# Altium project Main Pcb of Mobile robot.PrjPcb
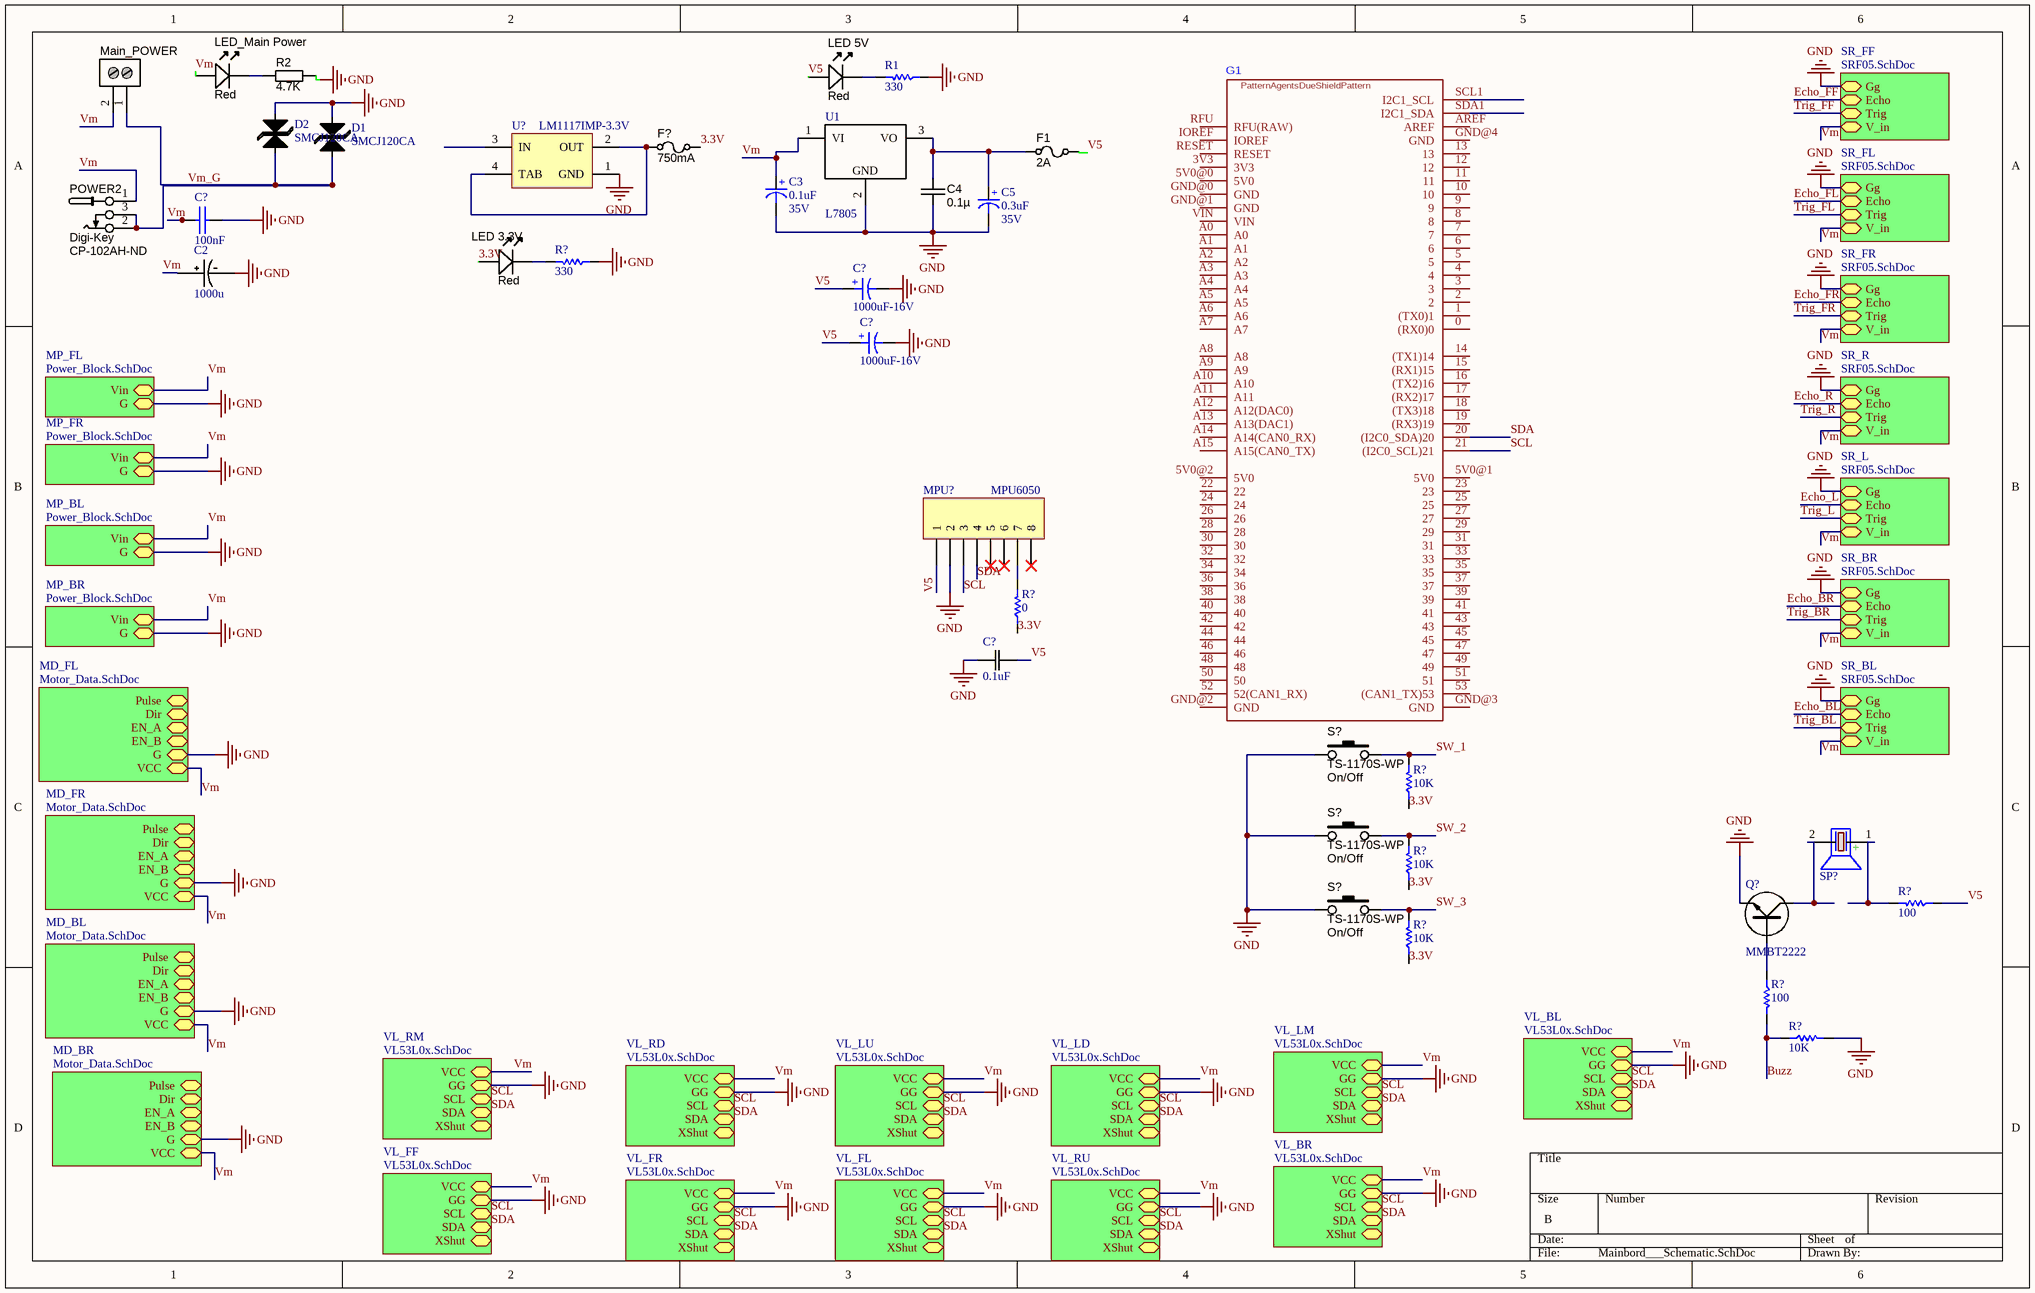
[diagram p0: Mainbord___Schematic.SchDoc]
9 sheets, 86 parts. Net scope: hierarchical (ports join the sheet entries above them; power ports are global).
Board file: Mainbord___PCB.PcbDoc
Sheets:
  Mainbord___Schematic.SchDoc
    MP_FR = Power_Block.SchDoc
    VL_FF = VL53L0x.SchDoc
    MP_FL = Power_Block.SchDoc
    MP_BL = Power_Block.SchDoc
    MP_BR = Power_Block.SchDoc
    SR_FF = SRF05.SchDoc
    SR_FL = SRF05.SchDoc
    SR_FR = SRF05.SchDoc
    SR_R = SRF05.SchDoc
    SR_L = SRF05.SchDoc
    SR_BR = SRF05.SchDoc
    SR_BL = SRF05.SchDoc
    MD_FL = Motor_Data.SchDoc
    MD_FR = Motor_Data.SchDoc
    MD_BL = Motor_Data.SchDoc
    MD_BR = Motor_Data.SchDoc
    VL_FR = VL53L0x.SchDoc
    VL_FL = VL53L0x.SchDoc
    VL_RM = VL53L0x.SchDoc
    VL_RD = VL53L0x.SchDoc
    VL_LU = VL53L0x.SchDoc
    VL_RU = VL53L0x.SchDoc
    VL_LD = VL53L0x.SchDoc
    VL_LM = VL53L0x.SchDoc
    VL_BR = VL53L0x.SchDoc
    VL_BL = VL53L0x.SchDoc
  Wifi.SchDoc
  ACC.SchDoc
  Power_24 to 12.SchDoc
  RadioControl.SchDoc

## Sheet Mainbord___Schematic.SchDoc
size B

### Parts
(Parts that share a designator on the sheet are numbered #1, #2 ... from top to bottom, then left to right.)
C2  1000u  [Cap electrolitic radial 10x16-5]
C3  Voltage: 35V  [cap 00]  (hidden comment: 0.1uF)
C4  value 0.1µ  [CAPC2012X135N]  (hidden comment: approved sub OK)
C5  Voltage: 35V  [cap 00]  (hidden comment: 0.3uF)
C?#1  100nF  [Cap - 100nF - 2]
C?#2  1000uF-16V  [CAP SMD 1000UF 16V]
C?#3  1000uF-16V  [CAP SMD 1000UF 16V]
C?#4  0.1uF  [0805]
D1  SMCJ120CA  [DIODE-SMC]
D2  SMCJ120CA  [DIODE-SMC]
F1  value 2A  [RESC3216X70N]  (hidden comment: Slow-blow)
F?  value 750mA  [RESC3216X70N]  (hidden comment: Slow-blow)
G1  (no value)  [Arduino_Due]
LED_3.3V  Color: Red  [LED-0805-K]
LED_5V  Color: Red  [LED-0805-K]
LED_Main_Power  Color: Red  [LED-0805-K]
Main_POWER  Stackable ScrewTerm  [CONN-TH_P9.50_KF950-9.5-2P]  (value not drawn)
MPU?  MPU6050  [HDR1X8]
POWER2  Supplier 1: Digi-Key  Supplier Part Number 1: CP-102AH-ND  [CONN_PWR_JACK_2.1x5.5mm]  (hidden comment: CONN_PWR_JACK_2.1x5.5mm)
Q?  MMBT2222  [SOT23-BCE]
R1  330  [RES 0805 (2012X06L)]
R2  value 4.7K  [RESC3216X70N]  (hidden comment: Thin Film)
R?#1  330  [RES 0805 (2012X06L)]
R?#2  0  [SMD_RES_0805]
R?#3  10K  [RES 0805 (2012X06L)]
R?#4  10K  [RES 0805 (2012X06L)]
R?#5  100  [RES 0805 (2012X06L)]
R?#6  10K  [RES 0805 (2012X06L)]
R?#7  100  [RES 0805 (2012X06L)]
R?#8  10K  [RES 0805 (2012X06L)]
S?#1  TS-1170S-WP  Function: On/Off  [TS-1170S]
S?#2  TS-1170S-WP  Function: On/Off  [TS-1170S]
S?#3  TS-1170S-WP  Function: On/Off  [TS-1170S]
SP?  (no value)  [BUZZER 7.62mm DC]
U1  L7805  [TO252-3M]
U?  LM1117IMP-3.3V  [TO-252]

### Sub-sheets
MD_BL = Motor_Data.SchDoc: Pulse (bidir), Dir (bidir), EN_A (bidir), EN_B (bidir), G (bidir), VCC (bidir)
MD_BR = Motor_Data.SchDoc: Pulse (bidir), Dir (bidir), EN_A (bidir), EN_B (bidir), G (bidir), VCC (bidir)
MD_FL = Motor_Data.SchDoc: Pulse (bidir), Dir (bidir), EN_A (bidir), EN_B (bidir), G (bidir), VCC (bidir)
MD_FR = Motor_Data.SchDoc: Pulse (bidir), Dir (bidir), EN_A (bidir), EN_B (bidir), G (bidir), VCC (bidir)
MP_BL = Power_Block.SchDoc: Vin (bidir), G (bidir)
MP_BR = Power_Block.SchDoc: Vin (bidir), G (bidir)
MP_FL = Power_Block.SchDoc: Vin (bidir), G (bidir)
MP_FR = Power_Block.SchDoc: Vin (bidir), G (bidir)
SR_BL = SRF05.SchDoc: Gg (bidir), V_in (bidir), Trig (bidir), Echo (bidir)
SR_BR = SRF05.SchDoc: Gg (bidir), V_in (bidir), Trig (bidir), Echo (bidir)
SR_FF = SRF05.SchDoc: Gg (bidir), V_in (bidir), Trig (bidir), Echo (bidir)
SR_FL = SRF05.SchDoc: Gg (bidir), V_in (bidir), Trig (bidir), Echo (bidir)
SR_FR = SRF05.SchDoc: Gg (bidir), V_in (bidir), Trig (bidir), Echo (bidir)
SR_L = SRF05.SchDoc: Gg (bidir), V_in (bidir), Trig (bidir), Echo (bidir)
SR_R = SRF05.SchDoc: Gg (bidir), V_in (bidir), Trig (bidir), Echo (bidir)
VL_BL = VL53L0x.SchDoc: VCC (bidir), GG (bidir), SCL (bidir), SDA (bidir), XShut (bidir)
VL_BR = VL53L0x.SchDoc: VCC (bidir), GG (bidir), SCL (bidir), SDA (bidir), XShut (bidir)
VL_FF = VL53L0x.SchDoc: VCC (bidir), GG (bidir), SCL (bidir), SDA (bidir), XShut (bidir)
VL_FL = VL53L0x.SchDoc: VCC (bidir), GG (bidir), SCL (bidir), SDA (bidir), XShut (bidir)
VL_FR = VL53L0x.SchDoc: VCC (bidir), GG (bidir), SCL (bidir), SDA (bidir), XShut (bidir)
VL_LD = VL53L0x.SchDoc: VCC (bidir), GG (bidir), SCL (bidir), SDA (bidir), XShut (bidir)
VL_LM = VL53L0x.SchDoc: VCC (bidir), GG (bidir), SCL (bidir), SDA (bidir), XShut (bidir)
VL_LU = VL53L0x.SchDoc: VCC (bidir), GG (bidir), SCL (bidir), SDA (bidir), XShut (bidir)
VL_RD = VL53L0x.SchDoc: VCC (bidir), GG (bidir), SCL (bidir), SDA (bidir), XShut (bidir)
VL_RM = VL53L0x.SchDoc: VCC (bidir), GG (bidir), SCL (bidir), SDA (bidir), XShut (bidir)
VL_RU = VL53L0x.SchDoc: VCC (bidir), GG (bidir), SCL (bidir), SDA (bidir), XShut (bidir)

### Nets
GND: C2.NEG C3.2(-) C4.2 C5.2(-) C?#1.2(-) C?#2.2 C?#3.2 C?#4.1(C1) D1.A D2.A MPU?.2 Q?.E R1.1 R2.2 R?#1.1 R?#8.2 S?#1.1 S?#2.1 S?#3.1 U1.2 U?.1(GND) ; sheet MP_FR/G, sheet VL_FF/GG, sheet MP_FL/G, sheet MP_BL/G, sheet MP_BR/G, sheet SR_FF/Gg, sheet SR_FL/Gg, sheet SR_FR/Gg, sheet SR_R/Gg, sheet SR_L/Gg, sheet SR_BR/Gg, sheet SR_BL/Gg, sheet MD_FL/G, sheet MD_FR/G, sheet MD_BL/G, sheet MD_BR/G, sheet VL_FR/GG, sheet VL_FL/GG, sheet VL_RM/GG, sheet VL_RD/GG, sheet VL_LU/GG, sheet VL_RU/GG, sheet VL_LD/GG, sheet VL_LM/GG, sheet VL_BR/GG, sheet VL_BL/GG  [project net G]
3.3V: F?.1 LED_3.3V.A R?#2.1 R?#3.1 R?#4.1 R?#6.1
Buzz: R?#7.2 R?#8.1
SCL: G1.21((I2C0_SCL)21) MPU?.3 ; sheet VL_FF/SCL, sheet VL_FR/SCL, sheet VL_FL/SCL, sheet VL_RM/SCL, sheet VL_RD/SCL, sheet VL_LU/SCL, sheet VL_RU/SCL, sheet VL_LD/SCL, sheet VL_LM/SCL, sheet VL_BR/SCL, sheet VL_BL/SCL
SDA: G1.20((I2C0_SDA)20) MPU?.4 ; sheet VL_FF/SDA, sheet VL_FR/SDA, sheet VL_FL/SDA, sheet VL_RM/SDA, sheet VL_RD/SDA, sheet VL_LU/SDA, sheet VL_RU/SDA, sheet VL_LD/SDA, sheet VL_LM/SDA, sheet VL_BR/SDA, sheet VL_BL/SDA
SW_1: R?#3.2 S?#1.2
SW_2: R?#4.2 S?#2.2
SW_3: R?#6.2 S?#3.2
V5: C?#2.1 C?#3.1 C?#4.2(C2) F1.2 LED_5V.A MPU?.1 R?#5.1
Vm: C2.POS C3.1(+) C?#1.1(+) LED_Main_Power.A Main_POWER.2 POWER2.1 U1.1(VI) ; sheet MP_FR/Vin, sheet VL_FF/VCC, sheet MP_FL/Vin, sheet MP_BL/Vin, sheet MP_BR/Vin, sheet SR_FF/V_in, sheet SR_FL/V_in, sheet SR_FR/V_in, sheet SR_R/V_in, sheet SR_L/V_in, sheet SR_BR/V_in, sheet SR_BL/V_in, sheet MD_FL/VCC, sheet MD_FR/VCC, sheet MD_BL/VCC, sheet MD_BR/VCC, sheet VL_FR/VCC, sheet VL_FL/VCC, sheet VL_RM/VCC, sheet VL_RD/VCC, sheet VL_LU/VCC, sheet VL_RU/VCC, sheet VL_LD/VCC, sheet VL_LM/VCC, sheet VL_BR/VCC, sheet VL_BL/VCC  [project net V5]
Vm_G: D1.K D2.K Main_POWER.1 POWER2.2 POWER2.3
NetC4_1: C4.1 C5.1(+) F1.1 U1.3(VO)
NetF?_2: F?.2 U?.2(OUT) U?.4(TAB)
NetLED_3.3V_K: LED_3.3V.K R?#1.2
NetLED_5V_K: LED_5V.K R1.2
NetLED_Main_Power_K: LED_Main_Power.K R2.1
NetMPU?_7: MPU?.7 R?#2.2
NetQ?_B: Q?.B R?#7.1
NetQ?_C: Q?.C SP?.2(-)
NetR?#5_2: R?#5.2 SP?.1(+)

Not connected (* = marked no-connect by the designer): G1 0((RX0)0) 1((TX0)1) 2 3 3V3 4 5 5V0@0(5V0) 5V0@1(5V0) 5V0@2(5V0) 6 7 8 9 10 11 12 13 14((TX1)14) 15((RX1)15) 16((TX2)16) 17((RX2)17) 18((TX3)18) 19((RX3)19) 22 23 24 25 26 27 28 29 30 31 32 33 34 35 36 37 38 39 40 41 42 43 44 45 46 47 48 49 50 51 52(52(CAN1_RX)) 53((CAN1_TX)53) A0 A1 A2 A3 A4 A5 A6 A7 A8 A9 A10 A11 A12(A12(DAC0)) A13(A13(DAC1)) A14(A14(CAN0_RX)) A15(A15(CAN0_TX)) AREF GND@0(GND) GND@1(GND) GND@2(GND) GND@3(GND) GND@4(GND) IOREF RESET RFU(RFU(RAW)) SCL1(I2C1_SCL) SDA1(I2C1_SDA) VIN; MPU? 5* 6* 8*; U? 3(IN)

### Notes on the sheet
- (in symbol ARDUINO DUE V2) PatternAgentsDueShieldPattern
- (in symbol Cap ELECTROLITIC TOTAL SIZE) +
- (in symbol L7805-D2PAK) GND

### Library data of the parts
C2 = CAP POL 1000uF TH: NICHICON   UVR1E102MPD1TD   ALUMINUM ELECTROLYTIC CAPACITOR, 1000UF, 25V, 20%, RADIAL, FULL REEL; pin to pad: NEG>2 POS>1; Dielectric Material: Aluminium; Life (Hours): 2000Hour; Capacitance: 1mF; Leakage Current: 750uA; Dissipation Factor: 0.16%; Ripple Current: 960mA; Lead Diameter: 0.6mm; Supplier 1: Digi-Key; Manufacturer: Nichicon; Manufacturer Part Number: UVR1E102MPD1TD; RoHS: Yes; Category: Aluminum Electrolytic Capacitors; Stock 1: 43448; Pricing 1: 1=0.58000, 10=0.40800, 100=0.26890 (USD); Mount: Through Hole,PCB; Case/Package: Radial; Number of Pins: 2; Min Operating Temperature: -40°C; Max Operating Temperature: 85°C; Packaging: Tape and Reel; Tolerance: 20%; Voltage Rating (DC): 25V; Voltage Rating: 25V; Termination: Radial; Voltage: 25V; Package Quantity: 500; Diameter: 10mm; Length: 20mm; Height: 20mm; Height - Seated (Max): 0.866inch; Lead Pitch: 5mm; Radiation Hardening: No; REACH SVHC: No SVHC; Lead Free: Lead Free; ComponentLink1URL: https://datasheet.ciiva.com/7851/e-vr-7851718.pdf?src-supplier=Element14; ComponentLink1Description: https://datasheet.ciiva.com/7851/e-vr-7851718.pdf?src-supplier=Element14; ComponentLink2URL: https://datasheet.ciiva.com/6300/e-vr-6300009.pdf?src-supplier=Digi-Key; ComponentLink2Description: https://datasheet.ciiva.com/6300/e-vr-6300009.pdf?src-supplier=Digi-Key; ComponentLink3URL: https://datasheet.ciiva.com/6300/e-vr-6300010.pdf?src-supplier=Digi-Key; ComponentLink3Description: https://datasheet.ciiva.com/6300/e-vr-6300010.pdf?src-supplier=Digi-Key; ComponentLink4URL: https://datasheet.ciiva.com/11684/e-vr-11684106.pdf?src-supplier=Avnet; ComponentLink4Description: https://datasheet.ciiva.com/11684/e-vr-11684106.pdf?src-supplier=Avnet; ComponentLink5URL: https://datasheet.ciiva.com/16502/e-vr-16502813.pdf?src-supplier=Future+Electronics; ComponentLink5Description: https://datasheet.ciiva.com/16502/e-vr-16502813.pdf?src-supplier=Future+Electronics; ComponentLink6URL: https://datasheet.ciiva.com/46381/1909356-46381757.pdf?src-supplier=Element14; ComponentLink6Description: https://datasheet.ciiva.com/46381/1909356-46381757.pdf?src-supplier=Element14; Supplier Part Number 1: 493-5913-1-ND
C3 C5 = Cap-Polar: Polar Capacitor; Designer: Saeid Jorablo; Organazation: ControTec; Adding Date: 1387/12/20
  C3: Value: 0.1uF
  C5: Value: 0.3uF
C4 = CAPC_1u_0805_X7R_16V_10%: Capacitor SMD Cer 1uF 10% 16V X7R 0805; Manufacturer 1: Yageo; Manufacturer Part Number 1: CC0805KKX7R7BB105; Ratings: 16V; X7R; Material: ceramic; SCDType: spec; Package / Case: 0805 (2012 metric); Tolerance: ±10%; Supplier 1: Digi-Key; Supplier Part Number 1: 311-1365-6-ND; RoHS 1: RoHS Compliant; Temperature Coefficient: X7R; ComponentLink1URL: http://www.yageo.com/documents/recent/UPY-GPHC_X7R_6.3V-to-50V_8.pdf; ComponentLink1Description: http://www.yageo.com/documents/recent/UPY-GPHC_X7R_6.3V-to-50V_8.pdf; Supplier 2: Digi-Key; Supplier Part Number 2: 399-1284-6-ND; Manufacturer 2: Kemet; Manufacturer Part Number 2: C0805C105K4RACTU; RoHS 2: RoHS Compliant; ComponentLink2URL: http://www.kemet.com/datasheets&C0805C105K4RACTU; ComponentLink2Description: http://www.kemet.com/datasheets&C0805C105K4RACTU; Supplier 3: Digi-Key; Supplier Part Number 3: 1276-1026-6-ND; Manufacturer 3: Samsung Electro-Mechanics America, Inc; Manufacturer Part Number 3: CL21B105KOFNNNE; RoHS 3: RoHS Compliant; ComponentLink3URL: http://www.samsungsem.com/servlet/FileDownload?type=spec&file=CL21B105KOFNNNE.pdf; ComponentLink3Description: http://www.samsungsem.com/servlet/FileDownload?type=spec&file=CL21B105KOFNNNE.pdf; Supplier 4: Digi-Key; Supplier Part Number 4: 445-1358-6-ND; Manufacturer 4: TDK Corporation; Manufacturer Part Number 4: C2012X7R1C105K125AA; RoHS 4: RoHS Compliant; ComponentLink4URL: http://product.tdk.com/capacitor/mlcc/en/documents/mlcc_commercial_general_en.pdf; ComponentLink4Description: http://product.tdk.com/capacitor/mlcc/en/documents/mlcc_commercial_general_en.pdf
C?#1 = Cap-Bipolar: Bipolar Capacitor; Voltage: 100V; Designer: Saeid Jorablo; Organazation: ControTec; Adding Date: 1387/12/20; Value: 100nF
C?#2 C?#3 = Cap ELECTROLITIC TOTAL SIZE: Cap electrolitic radial; Designer: Abbas Basereh; Data: 16-12-2016; Part. No: *; VALUE: 1000uF-16V
C?#4 = CAP 470nF 50V: CAP CER 0.1UF 50V X7R 0805; Value: 470nF; Tolerance: 10%; Package: 0805; Rating: 50V
D1 D2 = SMCJ120CA: Transient Surpression Diode TVS; Supplier 1: Digi-Key; Supplier Part Number 1: SMCJ120CABTR-ND
F1 F? = FUSE_160mA_1206: Fuse 160mA 63VDC 1206 SMD; Manufacturer 1: Holly Fuse; Manufacturer Part Number 1: 12T-0160L; Ratings: 160mA; 63VDC; slow-blow; SCDType: spec; Package / Case: 1206 (3216 metric)
G1 = ARDUINO DUE V2
LED_3.3V LED_5V LED_Main_Power = LED_SMD_Red_0805_6mcd: LED 0805 SMD Red 6mcd 621nm; Manufacturer 1: Lite-On Inc; Manufacturer Part Number 1: LTST-C171EKT; Ratings: 6 mcd; 621 nm; SCDType: source; Package / Case: 0805; Material: GaAsP on GaP; Supplier 1: Digi-Key; Supplier Part Number 1: 160-1422-1-ND; Value: Red
Main_POWER = 2P_ScrewTerm_90S_3.81MM: Terminal Block Screw Type THT 2-Position 3.81mm pitch; Manufacturer 1: Tyco Electronics; Manufacturer Part Number 1: 1776113-2; Value: 2 position; Pitch: 0.150" (3.81mm); Positions Per Level: 2; SCDType: undef; Package / Case: Side Entry; 3.81mm pitch; Category: Connectors Interconnects; Color: Black; Supplier 1: Digi-Key; Supplier Part Number 1: Fk950
MPU? = Header 8: Header, 8-Pin; LatestRevisionDate: 17-Jul-2002; LatestRevisionNote: Re-released for DXP Platform.; Publisher: Altium Limited
POWER2 = CONN_PWR_JACK_2.1x5.5mm: Power Connector, THT, 2.1mm ID, 5.5mm OD; Manufacturer 1: CUI Inc; Manufacturer Part Number 1: PJ-102AH; SCDType: undef; Category: Connectors; Mounting Type: Through Hole; Package / Case: PCB mount; Value: 2.1mm ID, 5.5mm OD
Q? = MMBT2222: BC847 SMALL SIGNAL NPN TRANSISTOR; Supplier 1: Digi-Key; Supplier Part Number 1: MMBT2222A-FDICT-ND
R1 R?#1-R?#8 = Resistor: Tolerance: 5%; Power: 1/8 W
  R1 R?#1: Value: 330
  R?#2: Value: 0
  R?#3 R?#4 R?#6 R?#8: Value: 10K
  R?#5 R?#7: Value: 100
R2 = RES_91R_1206_5%: Resistor SMD chip 91 Ohm 0.25W 5% 1206; Manufacturer 1: Yageo; Manufacturer Part Number 1: RC1206JR-0791RL; Ratings: 1/4 W; SCDType: spec; Package / Case: 1206 (3216 Metric); Tolerance: ±5%; Material: Thin Film; Supplier 1: Digi-Key; Supplier Part Number 1: 311-91ERCT-ND; ComponentLink1URL: http://www.yageo.com/documents/recent/PYu-RC1206_51_RoHS_L_4.pdf; ComponentLink1Description: http://www.yageo.com/documents/recent/PYu-RC1206_51_RoHS_L_4.pdf
S?#1-S?#3 = SW_SMD_PB_7.0mm: Switch SMD Tact 7.0mm Stem; Manufacturer 1: Bond-Tact; Manufacturer Part Number 1: TS-1170S-WP-200; SCDType: source; Package / Case: 6.5x6.5mm; 7.0mm stem; ComponentLink1URL: http://www.bondtact.com.hk/zaspx/productd.aspx?catno=3&subcatid=3&PageNo=2&productno=40; ComponentLink1Description: http://www.bondtact.com.hk/zaspx/productd.aspx?catno=3&subcatid=3&PageNo=2&productno=40
SP? = PIEZO BUZZER: PIEZO BUZZER ACTIVE; Designer: Abbas Basereh; Comment_1: SPEAKER AND BEEP; Design Date: 1395/11/14; ComponentLink2Description: Reference; PackageDescription: THD; Publisher: Abbas Basereh; Mounting Technology: THD; Pin Count: 2; Status: Unreleased
U1 = L7805-D2PAK: LINEAR REGULATOR 5.0V; pin to pad: 2>4; Supplier 1: Digi-Key; Supplier Part Number 1: 497-1170-6-ND
U? = LM1117IMP-x.x: x.x Volt, 800mA Low-Dropout Linear Regulator, 4-pin SOT-223; pin to pad: 2>4; Manufacturer: National Semiconductor; PackageTopMarking: XYTT*N05B; PowerWise: N; CompType: LDO IC; Published: 4-Dec-2008; DatasheetVersion: Apr-2006; PackageVersion: revB, Apr-2003; PackageReference: MP04A; Publisher: Altium Limited; PackageDescription: Molded SOT-223, 6.50 x 3.56 x 1.6mm Body, 4 Lead, 2.3mm Pitch; Supplier 1: Farnell; Supplier Part Number 1: 7614123; PartNumber: LM1117IMP-3.3; RoHS: N; PinCount: 4; Code_JEDEC: TO-261-AA; Code_IPC: SOT223-4; ComponentLink1Description: LM1117 Datasheet; ComponentLink1URL: http://www.national.com/ds/LM/LM1117.pdf; ComponentLink2Description: LM1117 Web Page; ComponentLink2URL: http://www.national.com/pf/LM/LM1117.html; ComponentLink3Description: MP04A Package Page; ComponentLink3URL: http://www.national.com/packaging/folders/mp04a.html

## Sheet Power_Block.SchDoc
size B
Used 4 times, as channels MP_FR, MP_FL, MP_BL, MP_BR. Parts and nets are listed once, with the designators drawn on the sheet.
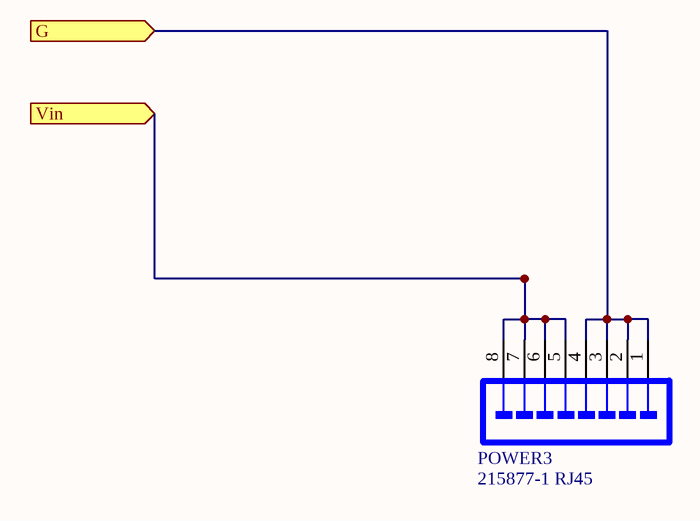
[diagram p1: Power_Block.SchDoc]

### Parts
POWER3  215877-1 RJ45  [Rj45_DS1127__HR911105A]

### Ports
G (in), Vin (in)

### Nets
G: POWER3.1 POWER3.2 POWER3.3 POWER3.4 ; port G
Vin: POWER3.5 POWER3.6 POWER3.7 POWER3.8 ; port Vin

### Channels
MP_FR: designators end in _Motor_Power_2; ports G=G Vin=V5
MP_FL: designators end in _Motor_Power_1; ports G=G Vin=V5
MP_BL: designators end in _MP_BL; ports G=G Vin=V5
MP_BR: designators end in _MP_BR; ports G=G Vin=V5

### Library data of the parts
POWER3 = 215877-1 RJ45: Female Header, Pitch 2.54 mm, 2 x 4 Position, Height 11.5 mm, Tail Length 3 mm, -40 to 105 degC, RoHS, Tape and Reel; Dynamic Catalog: Modular Jacks; Other Names: A105009CT; Number of Ports: 1; Connector Type: Jack; LED Color: Does Not Contain LED; Ratings: Cat3; Number of Positions/Contacts: 8p8c (RJ45, Ethernet); 3D Model: 215877-1.pdf; Tab Direction: Down; Shielding: Unshielded; DatasheetVersion: Rev. AE; PackageReference: THD; Supplier 1: Digi-Key; Supplier Part Number 1: A105009TR-ND; Supplier 2: Digi-Key; Supplier Part Number 2: A105009CT-ND; Features: Board Lock; Packaging: Cut Tape (CT); Termination: Solder; Family: Modular Connectors - Jacks; Contact Finish: Gold; Housing Material: Polybutylene Terephthalate (PBT); RoHS Information: 215877-1 Statement of Compliance; Mounting Type: Through Hole; Contact Material: Phosphor Bronze; Orientation: 90° Angle (Right); Standard Package: 1; Number of Rows: 1; Category: Connectors, Interconnects; ComponentLink1Description: Manufacturer URL; ComponentLink1URL: http://www.te.com; ComponentLink2Description: Datasheet; ComponentLink2URL: https://datasheet.ciiva.com/16310/215877-1-16310656.pdf

## Sheet VL53L0x.SchDoc
size B
Used 11 times, as channels VL_FF, VL_FR, VL_FL, VL_RM, VL_RD, VL_LU, VL_RU, VL_LD, VL_LM, VL_BR, VL_BL. Parts and nets are listed once, with the designators drawn on the sheet.
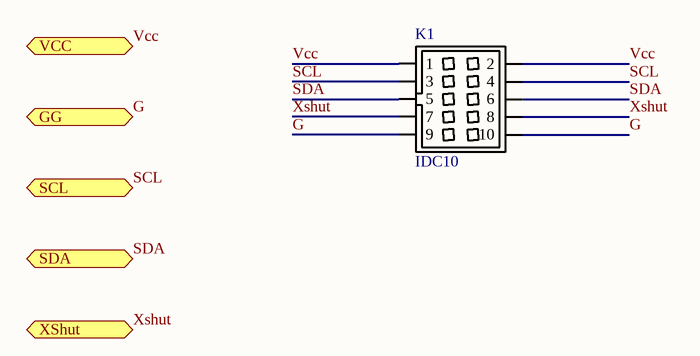
[diagram p2: VL53L0x.SchDoc]

### Parts
K1  IDC10  [IDC10-B]

### Ports
GG (bidir), SCL (bidir), SDA (bidir), VCC (bidir), XShut (bidir)

### Nets
G: K1.9 K1.10 ; port GG
SCL: K1.3 K1.4 ; port SCL
SDA: K1.5 K1.6 ; port SDA
Vcc: K1.1 K1.2 ; port VCC
Xshut: K1.7 K1.8 ; port XShut

### Channels
VL_FF: ports GG=G SCL=SCL SDA=SDA VCC=V5 XShut=Xshut_VL_FF
VL_FR: designators end in _VL_FR; ports GG=G SCL=SCL SDA=SDA VCC=V5 XShut=Xshut_VL_FR
VL_FL: designators end in _VL_FL; ports GG=G SCL=SCL SDA=SDA VCC=V5 XShut=Xshut_VL_FL
VL_RM: designators end in _VL_RM; ports GG=G SCL=SCL SDA=SDA VCC=V5 XShut=Xshut_VL_RM
VL_RD: designators end in _VL_RD; ports GG=G SCL=SCL SDA=SDA VCC=V5 XShut=Xshut_VL_RD
VL_LU: designators end in _VL_LU; ports GG=G SCL=SCL SDA=SDA VCC=V5 XShut=Xshut_VL_LU
VL_RU: designators end in _VL_RU; ports GG=G SCL=SCL SDA=SDA VCC=V5 XShut=Xshut_VL_RU
VL_LD: designators end in _VL_LD; ports GG=G SCL=SCL SDA=SDA VCC=V5 XShut=Xshut_VL_LD
VL_LM: designators end in _VL_LM; ports GG=G SCL=SCL SDA=SDA VCC=V5 XShut=Xshut_VL_LM
VL_BR: designators end in _VL_BR; ports GG=G SCL=SCL SDA=SDA VCC=V5 XShut=Xshut_VL_BR
VL_BL: designators end in _VL_BL; ports GG=G SCL=SCL SDA=SDA VCC=V5 XShut=Xshut_VL_BL

### Library data of the parts
K1 = IDC10: BOXHEADER 10 PIN; Manufacturer: Assmann Electronics Inc; Manufacturer Part Number: AWHW10G-0202-T-R; Connector Type: Header, Shrouded; Number of Positions: 10; Number of Positions Loaded: All; Pitch: 0.100" (2.54mm); Supplier 1: Digi-Key; Supplier Part Number 1: HRP10H-ND; Supplier: Digi-Key; Contact Type: Male Pin; RoHS: RoHS Compliant; Supplier Part Number: HRP10H-ND; Category: Connectors, Interconnects; Number of Rows: 2; Row Spacing: 0.100" (2.54mm); Contact Mating Length: -; Mounting Type: Through Hole; Termination: Solder; Fastening Type: -; Features: -; Contact Finish: Gold; Contact Finish Thickness: Flash; Color: Gray; Packaging: Tray

## Sheet SRF05.SchDoc
size B
Used 7 times, as channels SR_FF, SR_FL, SR_FR, SR_R, SR_L, SR_BR, SR_BL. Parts and nets are listed once, with the designators drawn on the sheet.
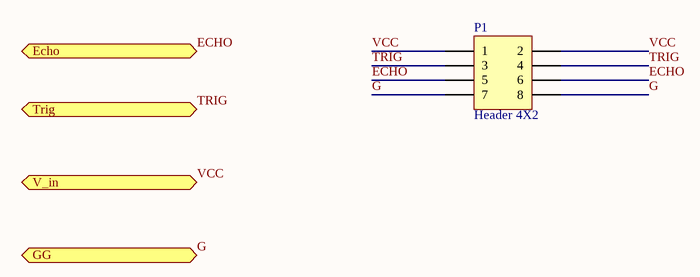
[diagram p3: SRF05.SchDoc]

### Parts
P1  Header 4X2  [HDR2X4]

### Ports
Echo (bidir), GG (bidir), Trig (bidir), V_in (bidir)

### Nets
ECHO: P1.5 P1.6 ; port Echo
G: P1.7 P1.8 ; port GG
TRIG: P1.3 P1.4 ; port Trig
VCC: P1.1 P1.2 ; port V_in

### Channels
SR_FF: ports Echo=ECHO_SR_FF GG=G Trig=TRIG_SR_FF V_in=V5
SR_FL: designators end in _SR_FL; ports Echo=ECHO_SR_FL GG=G Trig=TRIG_SR_FL V_in=V5
SR_FR: designators end in _SR_FR; ports Echo=ECHO_SR_FR GG=G Trig=TRIG_SR_FR V_in=V5
SR_R: designators end in _SR_R; ports Echo=ECHO_SR_R GG=G Trig=TRIG_SR_R V_in=V5
SR_L: designators end in _SR_L; ports Echo=ECHO_SR_L GG=G Trig=TRIG_SR_L V_in=V5
SR_BR: designators end in _SR_BR; ports Echo=ECHO_SR_BR GG=G Trig=TRIG_SR_BR V_in=V5
SR_BL: designators end in _SR_BL; ports Echo=ECHO_SR_BL GG=G Trig=TRIG_SR_BL V_in=V5

### Library data of the parts
P1 = Header 4X2: Header, 4-Pin, Dual row; LatestRevisionDate: 17-Jul-2002; LatestRevisionNote: Re-released for DXP Platform.; Publisher: Altium Limited

## Sheet Motor_Data.SchDoc
size B
Used 4 times, as channels MD_FL, MD_FR, MD_BL, MD_BR. Parts and nets are listed once, with the designators drawn on the sheet.
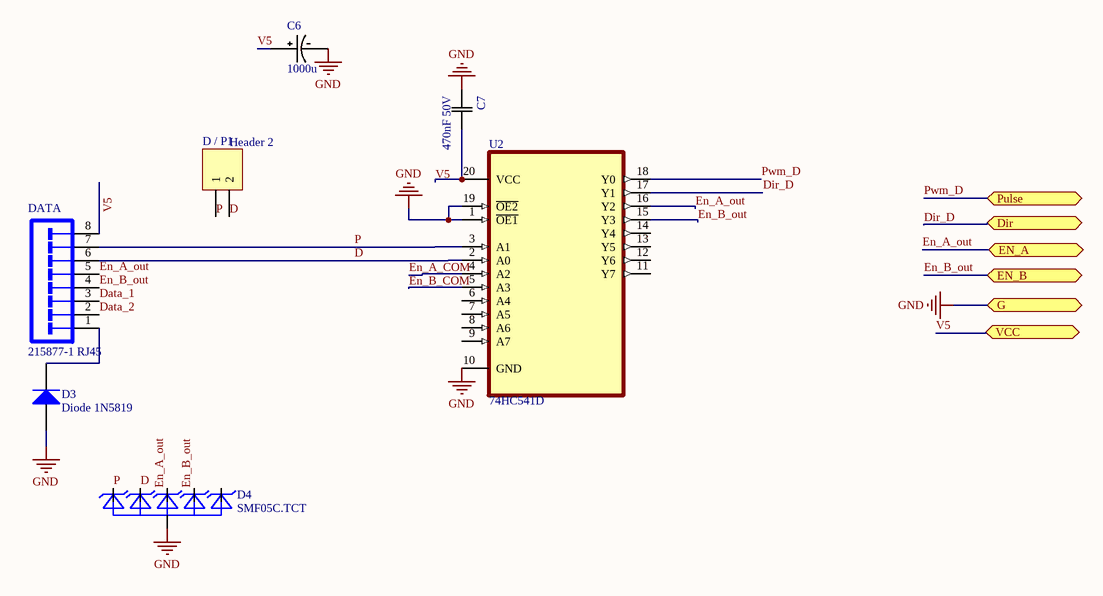
[diagram p4: Motor_Data.SchDoc]

### Parts
C6  1000u  [Cap electrolitic radial 10x16-5]
C7  470nF 50V  [0805]
D3  Diode 1N5819  [DO-214AC]
D4  SMF05C.TCT  [SC70-66]
D_/_P1  Header 2  [HDR1X2]
DATA  215877-1 RJ45  [HR911105A]
U2  74HC541D  [74HC541]

### Ports
Dir (bidir), EN_A (bidir), EN_B (bidir), G (bidir), Pulse (bidir), VCC (bidir)

### Nets
GND: C6.NEG C7.1(C1) D3.1(A) D4.2(A) U2.1(~{OE1}) U2.10(GND) U2.19(~{OE2}) ; port G
D: D4.3(C2) D_/_P1.2 DATA.6 U2.2(A0)
Data_1: DATA.3
Data_2: DATA.2
Dir_D: U2.17(Y1) ; port Dir
En_A_COM: U2.4(A2)
En_A_out: D4.4(C3) DATA.5 U2.16(Y2) ; port EN_A
En_B_COM: U2.5(A3)
En_B_out: D4.5(C4) DATA.4 U2.15(Y3) ; port EN_B
P: D4.1(C1) D_/_P1.1 DATA.7 U2.3(A1)
Pwm_D: U2.18(Y0) ; port Pulse
V5: C6.POS C7.2(C2) DATA.8 U2.20(VCC) ; port VCC
NetD3_2: D3.2(K) DATA.1

Not connected (* = marked no-connect by the designer): D4 6(C5); U2 6(A4) 7(A5) 8(A6) 9(A7) 11(Y7) 12(Y6) 13(Y5) 14(Y4)

### Channels
MD_FL: designators C6=C6_MD_FL C7=C7_MD_FL D3=D3_MD_FL D4=D4_MD_FL D / P1=D_/_P1_MD_FL DATA=DATA_MD_FL U2=U2_MD_FL; ports Dir=Dir_D_MD_FL EN_A=En_A_out_MD_FL EN_B=En_B_out_MD_FL G=G Pulse=Pwm_D_MD_FL VCC=V5
MD_FR: designators C6=C6_MD_FR C7=C7_MD_FR D3=D3_MD_FR D4=D4_MD_FR D / P1=D_/_P1_MD_FR DATA=DATA_MD_FR U2=U2_MD_FR; ports Dir=Dir_D_MD_FR EN_A=En_A_out_MD_FR EN_B=En_B_out_MD_FR G=G Pulse=Pwm_D_MD_FR VCC=V5
MD_BL: designators C6=C6_MD_BL C7=C7_MD_BL D3=D3_MD_BL D4=D4_MD_BL D / P1=D_/_P1_MD_BL DATA=DATA_MD_BL U2=U2_MD_BL; ports Dir=Dir_D_MD_BL EN_A=En_A_out_MD_BL EN_B=En_B_out_MD_BL G=G Pulse=Pwm_D_MD_BL VCC=V5
MD_BR: designators C6=C6_MD_BR C7=C7_MD_BR D3=D3_MD_BR D4=D4_MD_BR D / P1=D_/_P1_MD_BR DATA=DATA_MD_BR U2=U2_MD_BR; ports Dir=Dir_D_MD_BR EN_A=En_A_out_MD_BR EN_B=En_B_out_MD_BR G=G Pulse=Pwm_D_MD_BR VCC=V5

### Library data of the parts
C6 = CAP POL 1000uF TH: NICHICON   UVR1E102MPD1TD   ALUMINUM ELECTROLYTIC CAPACITOR, 1000UF, 25V, 20%, RADIAL, FULL REEL; pin to pad: NEG>2 POS>1; Dielectric Material: Aluminium; Life (Hours): 2000Hour; Capacitance: 1mF; Leakage Current: 750uA; Dissipation Factor: 0.16%; Ripple Current: 960mA; Lead Diameter: 0.6mm; Supplier 1: Digi-Key; Manufacturer: Nichicon; Manufacturer Part Number: UVR1E102MPD1TD; RoHS: Yes; Category: Aluminum Electrolytic Capacitors; Stock 1: 43448; Pricing 1: 1=0.58000, 10=0.40800, 100=0.26890 (USD); Mount: Through Hole,PCB; Case/Package: Radial; Number of Pins: 2; Min Operating Temperature: -40°C; Max Operating Temperature: 85°C; Packaging: Tape and Reel; Tolerance: 20%; Voltage Rating (DC): 25V; Voltage Rating: 25V; Termination: Radial; Voltage: 25V; Package Quantity: 500; Diameter: 10mm; Length: 20mm; Height: 20mm; Height - Seated (Max): 0.866inch; Lead Pitch: 5mm; Radiation Hardening: No; REACH SVHC: No SVHC; Lead Free: Lead Free; ComponentLink1URL: https://datasheet.ciiva.com/7851/e-vr-7851718.pdf?src-supplier=Element14; ComponentLink1Description: https://datasheet.ciiva.com/7851/e-vr-7851718.pdf?src-supplier=Element14; ComponentLink2URL: https://datasheet.ciiva.com/6300/e-vr-6300009.pdf?src-supplier=Digi-Key; ComponentLink2Description: https://datasheet.ciiva.com/6300/e-vr-6300009.pdf?src-supplier=Digi-Key; ComponentLink3URL: https://datasheet.ciiva.com/6300/e-vr-6300010.pdf?src-supplier=Digi-Key; ComponentLink3Description: https://datasheet.ciiva.com/6300/e-vr-6300010.pdf?src-supplier=Digi-Key; ComponentLink4URL: https://datasheet.ciiva.com/11684/e-vr-11684106.pdf?src-supplier=Avnet; ComponentLink4Description: https://datasheet.ciiva.com/11684/e-vr-11684106.pdf?src-supplier=Avnet; ComponentLink5URL: https://datasheet.ciiva.com/16502/e-vr-16502813.pdf?src-supplier=Future+Electronics; ComponentLink5Description: https://datasheet.ciiva.com/16502/e-vr-16502813.pdf?src-supplier=Future+Electronics; ComponentLink6URL: https://datasheet.ciiva.com/46381/1909356-46381757.pdf?src-supplier=Element14; ComponentLink6Description: https://datasheet.ciiva.com/46381/1909356-46381757.pdf?src-supplier=Element14; Supplier Part Number 1: 493-5913-1-ND
C7 = CAP 470nF 50V: CAP CER 0.1UF 50V X7R 0805; Tolerance: 10%; Package: 0805; Value: 470nF; Rating: 50V
D3 = Diode 1N5819: SS14; pin to pad: 1>A 2>C; ComponentLink1Description: Manufacturer Link; ComponentLink1URL: http://www.irf.com/
D4 = SMF05C.TCT: 12.5V Clamp 8A _8/20Âµs_ Ipp Tvs Diode Surface Mount SC-70-6; MF: Semtech; Price: None; Value: *; MP: SMF05C.TCT; Package: SOT-363 Diodes Inc.; SnapEDA_Link: https://www.snapeda.com/parts/SMF05C.TCT/Semtech%20Corporation/view-part/1264306/?ref=snap; Availability: Unavailable
D_/_P1 = Header 2: Header, 2-Pin; LatestRevisionDate: 17-Jul-2002; LatestRevisionNote: Re-released for DXP Platform.; Publisher: Altium Limited
DATA = 215877-1 RJ45: as POWER3 on sheet Power_Block; DatasheetVersion: Rev. AE; PackageReference: THD; Supplier 1: Digi-Key; Supplier Part Number 1: A105009TR-ND; Supplier 2: Digi-Key; Supplier Part Number 2: A105009CT-ND; Features: Board Lock; Packaging: Cut Tape (CT); Termination: Solder; Family: Modular Connectors - Jacks; Contact Finish: Gold; Housing Material: Polybutylene Terephthalate (PBT); RoHS Information: 215877-1 Statement of Compliance; Mounting Type: Through Hole; Contact Material: Phosphor Bronze; Orientation: 90° Angle (Right); Standard Package: 1; Number of Rows: 1; Category: Connectors, Interconnects; ComponentLink1Description: Manufacturer URL; ComponentLink1URL: http://www.te.com; ComponentLink2Description: Datasheet; ComponentLink2URL: https://datasheet.ciiva.com/16310/215877-1-16310656.pdf
U2 = 74HC541D: Buffer, Non-Inverting 1 Element 8 Bit per Element 3-State Output 20-SOIC; MF: Toshiba Semiconductor; Price: None; Availability: Unavailable; SnapEDA_Link: https://www.snapeda.com/parts/74HC541D/Toshiba%20Semiconductor%20and%20Storage/view-part/2887736/?ref=snap; Value: *; Package: SOIC-20 Toshiba; MP: 74HC541D

## Sheet Wifi.SchDoc
size B

## Sheet ACC.SchDoc
size B

## Sheet Power_24 to 12.SchDoc
size B

## Sheet RadioControl.SchDoc
size B

## Nets that join several sheets
G: Mainbord___Schematic (21 pins), MP_FR (POWER3_Motor_Power_2.1 POWER3_Motor_Power_2.2 POWER3_Motor_Power_2.3 POWER3_Motor_Power_2.4), VL_FF (K1.9 K1.10), MP_FL (POWER3_Motor_Power_1.1 POWER3_Motor_Power_1.2 POWER3_Motor_Power_1.3 POWER3_Motor_Power_1.4), MP_BL (POWER3_MP_BL.1 POWER3_MP_BL.2 POWER3_MP_BL.3 POWER3_MP_BL.4), MP_BR (POWER3_MP_BR.1 POWER3_MP_BR.2 POWER3_MP_BR.3 POWER3_MP_BR.4), SR_FF (P1.7 P1.8), SR_FL (P1_SR_FL.7 P1_SR_FL.8), SR_FR (P1_SR_FR.7 P1_SR_FR.8), SR_R (P1_SR_R.7 P1_SR_R.8), SR_L (P1_SR_L.7 P1_SR_L.8), SR_BR (P1_SR_BR.7 P1_SR_BR.8), SR_BL (P1_SR_BL.7 P1_SR_BL.8), MD_FL (7 pins), MD_FR (7 pins), MD_BL (7 pins), MD_BR (7 pins), VL_FR (K1_VL_FR.9 K1_VL_FR.10), VL_FL (K1_VL_FL.9 K1_VL_FL.10), VL_RM (K1_VL_RM.9 K1_VL_RM.10), VL_RD (K1_VL_RD.9 K1_VL_RD.10), VL_LU (K1_VL_LU.9 K1_VL_LU.10), VL_RU (K1_VL_RU.9 K1_VL_RU.10), VL_LD (K1_VL_LD.9 K1_VL_LD.10), VL_LM (K1_VL_LM.9 K1_VL_LM.10), VL_BR (K1_VL_BR.9 K1_VL_BR.10), VL_BL (K1_VL_BL.9 K1_VL_BL.10)
SCL: Mainbord___Schematic (G1.21 MPU?.3), VL_FF (K1.3 K1.4), VL_FR (K1_VL_FR.3 K1_VL_FR.4), VL_FL (K1_VL_FL.3 K1_VL_FL.4), VL_RM (K1_VL_RM.3 K1_VL_RM.4), VL_RD (K1_VL_RD.3 K1_VL_RD.4), VL_LU (K1_VL_LU.3 K1_VL_LU.4), VL_RU (K1_VL_RU.3 K1_VL_RU.4), VL_LD (K1_VL_LD.3 K1_VL_LD.4), VL_LM (K1_VL_LM.3 K1_VL_LM.4), VL_BR (K1_VL_BR.3 K1_VL_BR.4), VL_BL (K1_VL_BL.3 K1_VL_BL.4)
SDA: Mainbord___Schematic (G1.20 MPU?.4), VL_FF (K1.5 K1.6), VL_FR (K1_VL_FR.5 K1_VL_FR.6), VL_FL (K1_VL_FL.5 K1_VL_FL.6), VL_RM (K1_VL_RM.5 K1_VL_RM.6), VL_RD (K1_VL_RD.5 K1_VL_RD.6), VL_LU (K1_VL_LU.5 K1_VL_LU.6), VL_RU (K1_VL_RU.5 K1_VL_RU.6), VL_LD (K1_VL_LD.5 K1_VL_LD.6), VL_LM (K1_VL_LM.5 K1_VL_LM.6), VL_BR (K1_VL_BR.5 K1_VL_BR.6), VL_BL (K1_VL_BL.5 K1_VL_BL.6)
V5: Mainbord___Schematic (7 pins), MP_FR (POWER3_Motor_Power_2.5 POWER3_Motor_Power_2.6 POWER3_Motor_Power_2.7 POWER3_Motor_Power_2.8), VL_FF (K1.1 K1.2), MP_FL (POWER3_Motor_Power_1.5 POWER3_Motor_Power_1.6 POWER3_Motor_Power_1.7 POWER3_Motor_Power_1.8), MP_BL (POWER3_MP_BL.5 POWER3_MP_BL.6 POWER3_MP_BL.7 POWER3_MP_BL.8), MP_BR (POWER3_MP_BR.5 POWER3_MP_BR.6 POWER3_MP_BR.7 POWER3_MP_BR.8), SR_FF (P1.1 P1.2), SR_FL (P1_SR_FL.1 P1_SR_FL.2), SR_FR (P1_SR_FR.1 P1_SR_FR.2), SR_R (P1_SR_R.1 P1_SR_R.2), SR_L (P1_SR_L.1 P1_SR_L.2), SR_BR (P1_SR_BR.1 P1_SR_BR.2), SR_BL (P1_SR_BL.1 P1_SR_BL.2), MD_FL (C6_MD_FL.POS C7_MD_FL.2 DATA_MD_FL.8 U2_MD_FL.20), MD_FR (C6_MD_FR.POS C7_MD_FR.2 DATA_MD_FR.8 U2_MD_FR.20), MD_BL (C6_MD_BL.POS C7_MD_BL.2 DATA_MD_BL.8 U2_MD_BL.20), MD_BR (C6_MD_BR.POS C7_MD_BR.2 DATA_MD_BR.8 U2_MD_BR.20), VL_FR (K1_VL_FR.1 K1_VL_FR.2), VL_FL (K1_VL_FL.1 K1_VL_FL.2), VL_RM (K1_VL_RM.1 K1_VL_RM.2), VL_RD (K1_VL_RD.1 K1_VL_RD.2), VL_LU (K1_VL_LU.1 K1_VL_LU.2), VL_RU (K1_VL_RU.1 K1_VL_RU.2), VL_LD (K1_VL_LD.1 K1_VL_LD.2), VL_LM (K1_VL_LM.1 K1_VL_LM.2), VL_BR (K1_VL_BR.1 K1_VL_BR.2), VL_BL (K1_VL_BL.1 K1_VL_BL.2)